# EAGLE design pth_supply_servos (EAGLE 6.1)
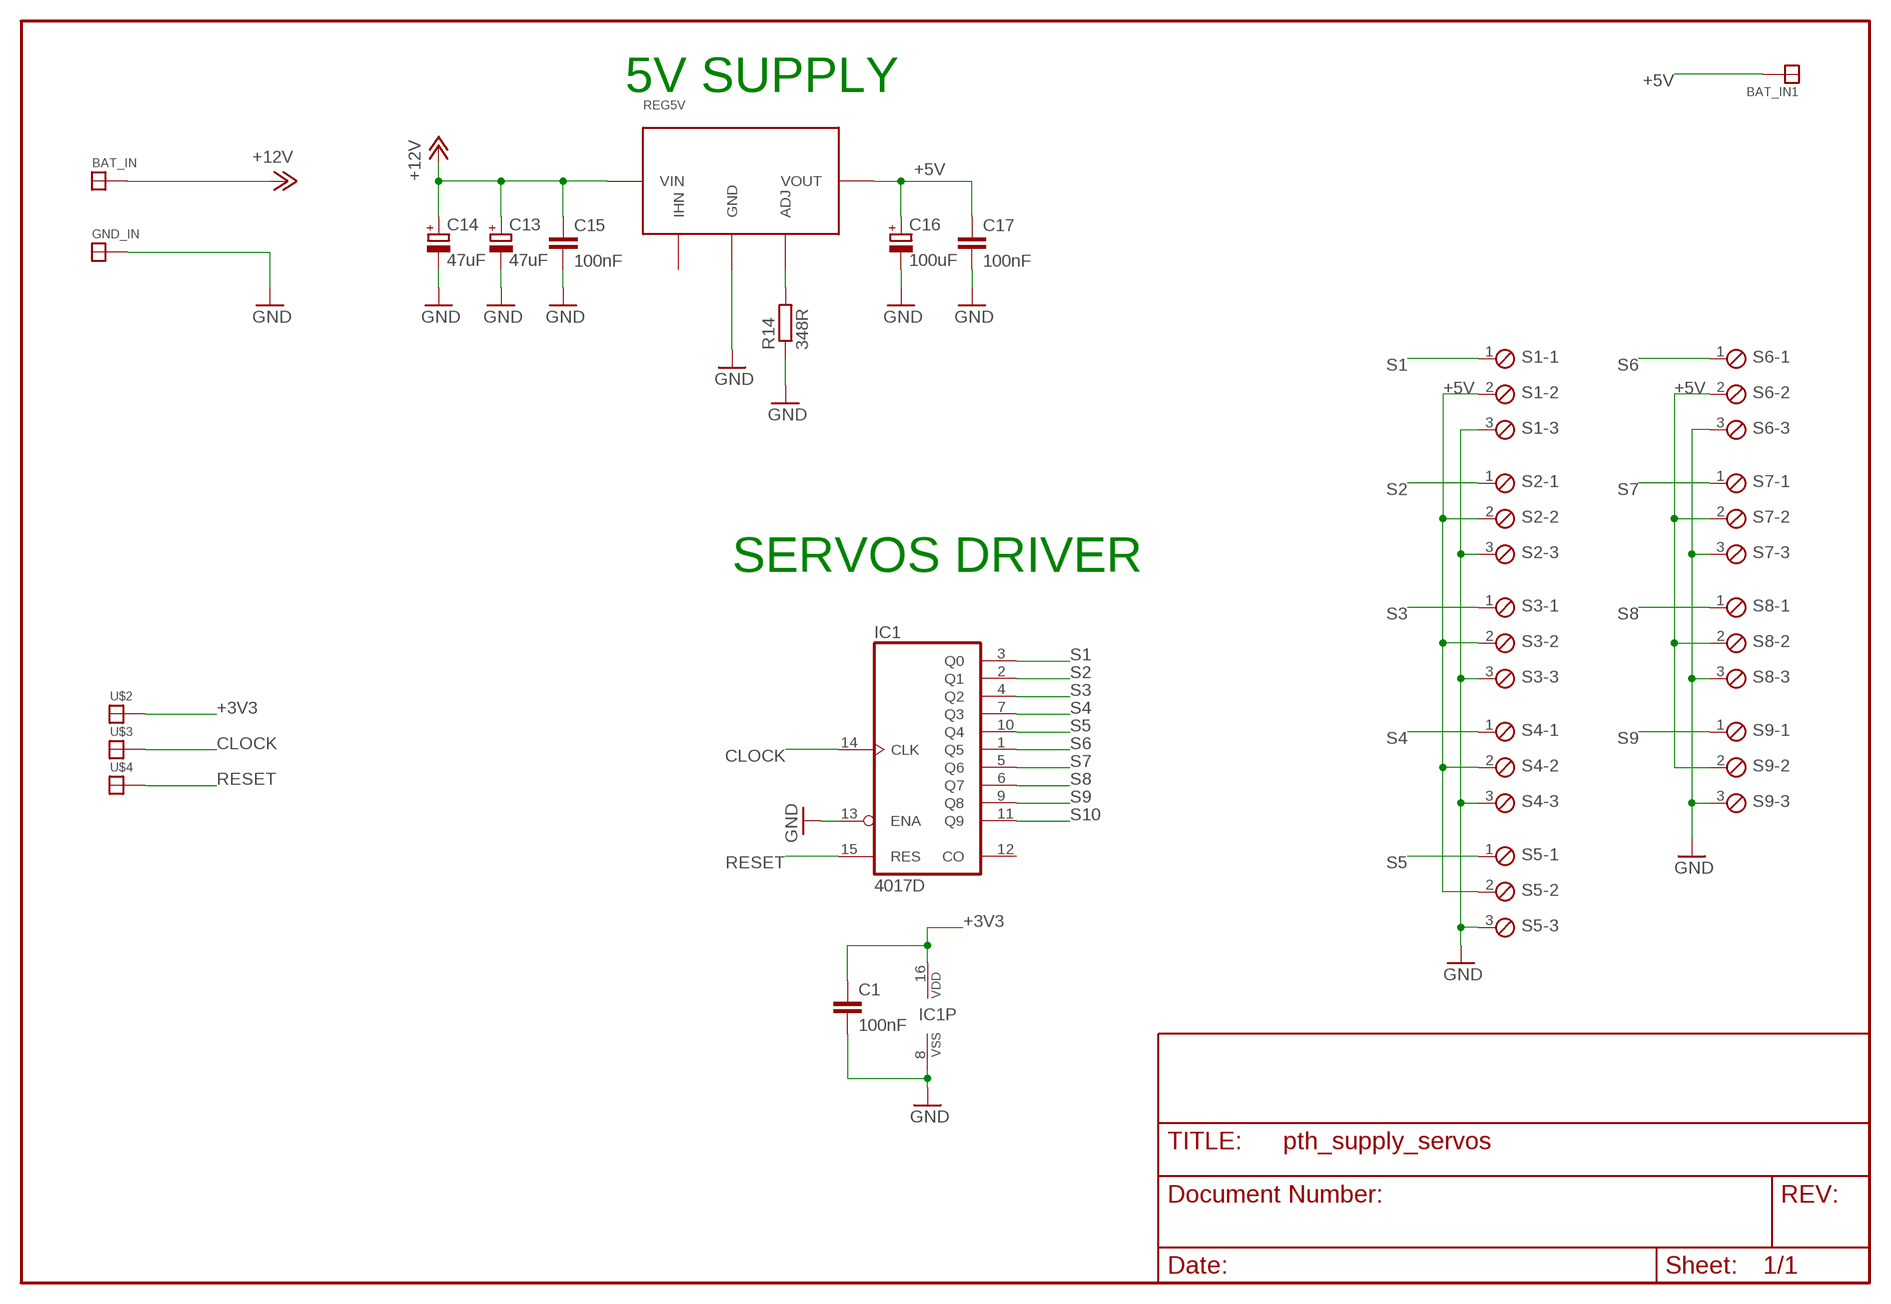
[diagram p0: schematic, sheet 1]

## Parts
BAT_IN  SOLDER_PAD150_75  [SOLD_PAD_150_75]
BAT_IN1  SOLDER_PAD150_75  [SOLD_PAD_150_75]
C1  100nF  C-EUC0805K  [C0805K]
C13  47uF  CPOL-EUSMCD  [SMC_D]
C14  47uF  CPOL-EUSMCD  [SMC_D]
C15  100nF  C-EUC0805K  [C0805K]
C16  100uF  CPOL-EUSMCD  [SMC_D]
C17  100nF  C-EUC0805K  [C0805K]
GND_IN  SOLDER_PAD150_75  [SOLD_PAD_150_75]
IC1  4017D  [SO16]
R14  348R  R-EU_R0805  [R0805]
REG5V  PTH  [PTH]
S1  MPT3  [3POL254]
S2  MPT3  [3POL254]
S3  MPT3  [3POL254]
S4  MPT3  [3POL254]
S5  MPT3  [3POL254]
S6  MPT3  [3POL254]
S7  MPT3  [3POL254]
S8  MPT3  [3POL254]
S9  MPT3  [3POL254]
U$2  SOLDER_PAD100_50  [SOLDER_PAD_100_50]
U$3  SOLDER_PAD100_50  [SOLDER_PAD_100_50]
U$4  SOLDER_PAD100_50  [SOLDER_PAD_100_50]

## Nets
+3V3: C1.1 IC1.16(VDD) U$2.P$1
+5V: BAT_IN1.P$1 C16.+ C17.1 REG5V.P$3(VOUT) S1.2 S2.2 S3.2 S4.2 S5.2 S6.2 S7.2 S8.2 S9.2
+12V: BAT_IN.P$1 C13.+ C14.+ C15.1 REG5V.P$1(VIN)
CLOCK: IC1.14(CLK) U$3.P$1
GND: C1.2 C13.- C14.- C15.2 C16.- C17.2 GND_IN.P$1 IC1.8(VSS) IC1.13(ENA) R14.1 REG5V.P$2(GND) S1.3 S2.3 S3.3 S4.3 S5.3 S6.3 S7.3 S8.3 S9.3
N$5: R14.2 REG5V.P$4(ADJ)
RESET: IC1.15(RES) U$4.P$1
S1: IC1.3(Q0) S1.1
S2: IC1.2(Q1) S2.1
S3: IC1.4(Q2) S3.1
S4: IC1.7(Q3) S4.1
S5: IC1.10(Q4) S5.1
S6: IC1.1(Q5) S6.1
S7: IC1.5(Q6) S7.1
S8: IC1.6(Q7) S8.1
S9: IC1.9(Q8) S9.1
S10: IC1.11(Q9)
Unconnected: IC1.12(CO) REG5V.P$5(IHN)

## Notes on the sheet
- 5V SUPPLY
- SERVOS DRIVER

## Library data of the parts
BAT_IN BAT_IN1 GND_IN U$2-U$4 = paparazzi:SOLDER_PAD
C1 C15 C17 = rcl:C-EU: CAPACITOR, European symbol
C13 C14 C16 = rcl:CPOL-EU: POLARIZED CAPACITOR, European symbol
IC1 = 40xx:4017: COUNTER/DIVIDER
R14 = rcl:R-EU_: RESISTOR, European symbol
REG5V = paparazzi:PTH
S1-S9 = paparazzi:MPT3: PHOENIX CONNECTOR

## Board
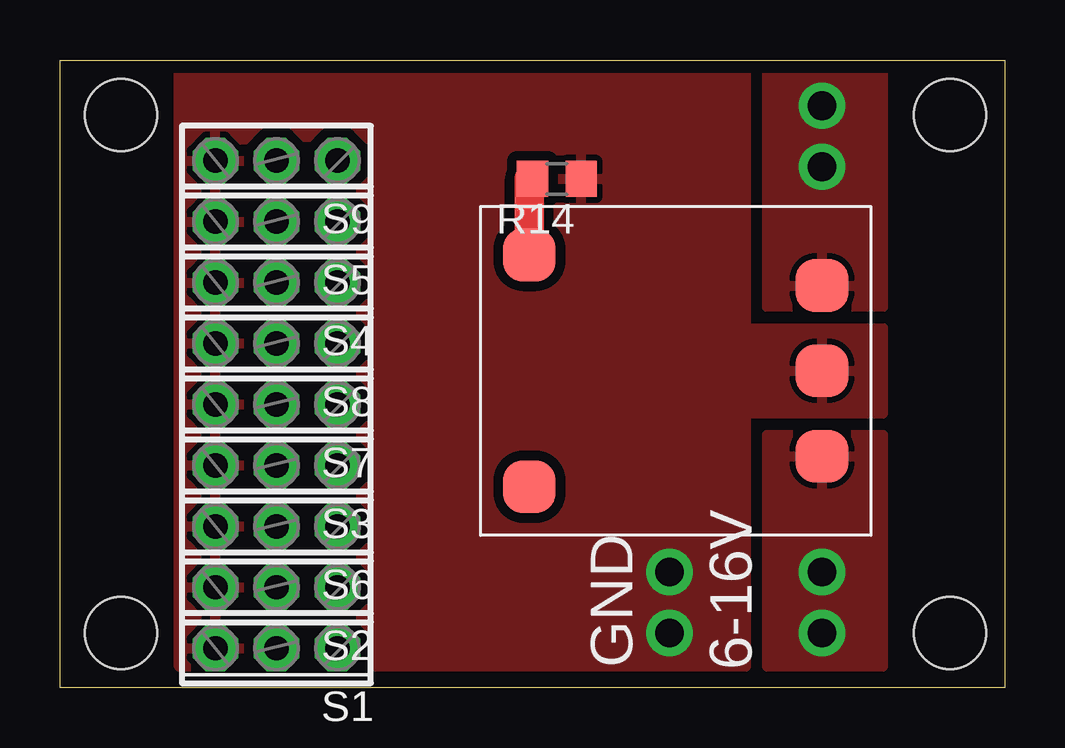
[diagram p1: board, top side]
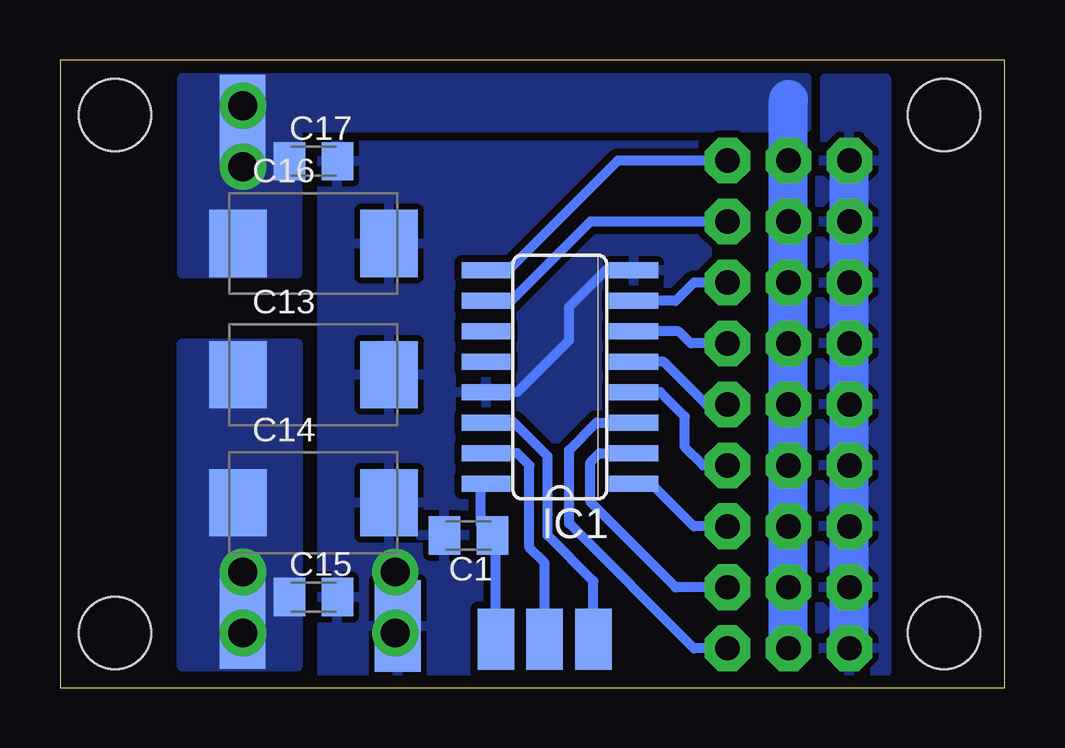
[diagram p2: board, bottom side, seen from below]

Size 39.37 x 26.16 mm. Coordinates in mm from the lower left corner, seen from the top.
Outline: 0,26.16 39.37,26.16 39.37,0 0,0 0,26.16
Copper layers (1*16): Top 0.035mm / dielectric 1.5mm / Bottom 0.035mm
Design rules: minimum track width 10mil, minimum drill 19mil, track to track 8mil, track to pad 8mil, pad to pad 8mil, via to via 8mil, smd to smd 8mil, copper to edge 20mil, drill to drill 8mil, minimum pad ring 10mil, minimum via ring 8mil, stop-mask expansion 4mil, vias tented up to drill 0mil, thermal gap 10mil
Holes 3 mm at 2.54,23.88 2.54,2.29 37.08,2.29 37.08,23.88

### Footprints (pad centres in the part's own frame; a part is rotated, then mirrored left to right if it is on the bottom)
SOLD_PAD_150_75 = smd 3.81 x 1.905: P$1 0,0
C0805K = smd 1.3 x 1.6: 1 -1,0; 2 1,0
SMC_D = smd 2.4 x 2.8: + -3.15,0; - 3.15,0
SO16 = smd 0.66 x 2.032: 1 -4.445,-3.073; 2 -3.175,-3.073; 3 -1.905,-3.073; 4 -0.635,-3.073; 5 0.635,-3.073; 6 1.905,-3.073; 7 3.175,-3.073; 8 4.445,-3.073; 9 4.445,3.073; 10 3.175,3.073; 11 1.905,3.073; 12 0.635,3.073; 13 -0.635,3.073; 14 -1.905,3.073; 15 -3.175,3.073; 16 -4.445,3.073
R0805 = smd 1.3 x 1.5: 1 -1.012,0; 2 1.012,0
PTH = smd 2.184 x 2.184: P$1 -6.096,3.556; P$2 -6.096,0; P$3 -6.096,-3.556; P$4 6.096,-4.826; P$5 6.096,4.826
3POL254 = drill 1.016 pad 1.905 octagon: 1 -2.54,0; 2 0,0; 3 2.54,0
SOLDER_PAD_100_50 = smd 2.54 x 1.524: P$1 0,0

### Placement (x,y rotation side)
BAT_IN  31.77,2.7 90 bottom
BAT_IN1  31.77,23.65 90 bottom
C1  22.35,6.35 180 bottom
C13  28.81,13.05 0 bottom
C14  28.81,7.72 0 bottom
C15  28.81,3.78 0 bottom
C16  28.81,18.51 0 bottom
C17  28.81,21.94 0 bottom
GND_IN  25.29,2.57 90 bottom
IC1  18.54,12.95 90 bottom
R14  20.7,21.21 180 top
REG5V  25.65,13.21 180 top
S1  9.02,1.65 180 top
S2  9.02,4.19 180 top
S3  9.02,9.27 180 top
S4  9.02,16.89 180 top
S5  9.02,19.43 180 top
S6  9.02,6.73 180 top
S7  9.02,11.81 180 top
S8  9.02,14.35 180 top
S9  9.02,21.97 180 top
U$2  21.21,2.03 90 bottom
U$3  17.15,2.03 90 bottom
U$4  19.18,2.03 270 bottom

### Tracks (layer width: path | path; a pad name or v marks a point on that pad's centre or on a via)
+3V3
  Bottom 0.406: U$2.P$1 21.21,6.22 21.84,6.86 | 21.84,6.86 C1.1 | IC1.16 21.84,8.28 21.84,6.86
+5V  (via drill 1.2 pad 1.93)
  Bottom 1.626: 32.26,18.8 C16.+ | S3.2 9.02,9.14 | S3.2 S7.2 S8.2 S4.2 S5.2 S9.2 9.02,24.51 | S6.2 9.02,6.6 | S6.2 S3.2 | S6.2 S2.2 S1.2
  other vias: 31.75,24.26 31.75,21.72
  pour Bottom (isolate 0.305, no thermals): 34.29,25.4 34.29,17.27 29.46,17.27 29.46,23.37 8.26,23.37 8.26,25.4
  pour Top: 34.29,25.65 34.29,15.88 29.46,15.88 29.46,23.5 29.46,25.65
+12V  (via drill 1.2 pad 1.93)
  other vias: 31.75,4.83 31.75,2.29
  pour Bottom (no thermals): 34.29,0.89 34.29,14.35 29.46,14.35 29.46,0.89
  pour Top: 34.29,10.54 34.29,0.89 29.46,0.89 29.46,10.54
CLOCK
  Bottom 0.406: U$3.P$1 17.15,4.44 19.05,6.35 19.05,9.65 20.45,11.05 IC1.14
GND  (via drill 1.2 pad 1.93)
  Top 0.406: REG5V.P$2 31.62,13.08
  Bottom 0.406: IC1.8 16.64,17.4 18.16,15.88 18.16,14.48 20.32,12.32 IC1.13
  Bottom 1.626: S9.3 S5.3 S4.3 | S4.3 6.48,16.76 | S4.3 S8.3 S7.3 S3.3 S6.3 | S6.3 6.48,6.6 | S2.3 6.48,4.06 | S2.3 S6.3 | S1.3 S2.3
  other vias: 25.4,4.83 25.4,2.29
  pour Top (isolate 0.406): 4.95,25.65 28.58,25.65 28.58,14.99 34.29,14.99 34.29,11.43 28.58,11.43 28.58,0.89 4.95,0.89
  pour Bottom (isolate 0.305): 28.45,22.61 7.49,22.61 7.49,25.4 4.95,25.4 4.95,0.64 28.45,0.64
N$5
  Top 1.219: R14.2 19.56,21.21 REG5V.P$4
RESET
  Bottom 0.406: IC1.15 20.32,9.78 19.81,9.27 19.81,5.84 19.18,5.21 U$4.P$1
S1
  Bottom 0.406: IC1.3 17.02,11.05 18.16,9.91 18.16,6.86 12.95,1.65 S1.1
S2
  Bottom 0.406: 15.37,9.78 IC1.2 16.89,9.78 17.27,9.4 17.27,7.75 13.72,4.19 S2.1
S3
  Bottom 0.406: IC1.4 14.35,12.32 13.33,11.3 13.33,10.03 12.57,9.27 S3.1
S4
  Bottom 0.406: IC1.7 13.72,16.13 12.95,16.89 S4.1
S5
  Bottom 0.406: 21.72,16.13 IC1.10 20.57,16.13 17.27,19.43 S5.1
S6
  Bottom 0.406: IC1.1 14.73,8.51 12.95,6.73 S6.1
S7
  Bottom 0.406: IC1.5 14.22,13.59 12.45,11.81 S7.1
S8
  Bottom 0.406: IC1.6 13.59,14.86 13.08,14.35 S8.1
S9
  Bottom 0.406: IC1.9 20.7,17.4 16.13,21.97 S9.1
S10
  Bottom 0.406: IC1.11 21.59,14.86

### Text on the board
tPlace: GND | 6-16V
tDocu: 9 | 5 | 4 | 8 | 7 | 3 | 6 | Paparazzi | PTH08080 Servos 1.0 | 07/02 by J & Poine | 2 | 1